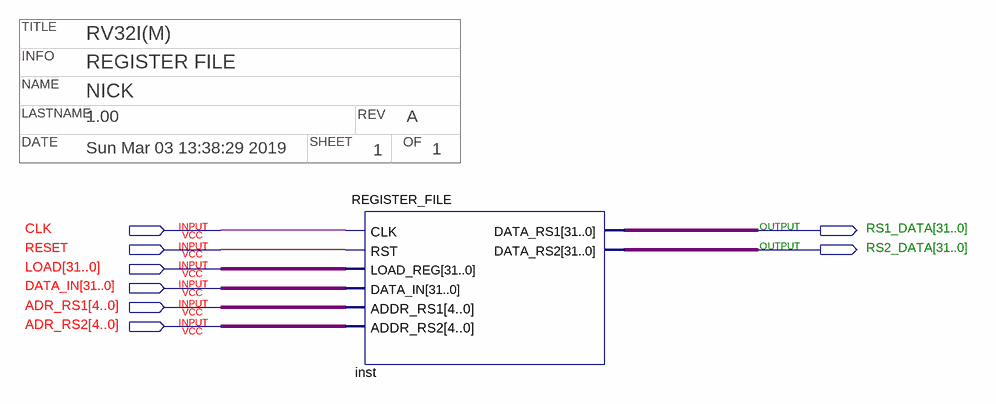
[diagram p0: schematic sheet]
// Quartus schematic REGISTER_FILETEST.bdf as structural Verilog: 1 symbols, 8 pins
// Title block: TITLE: RV32I(M); INFO: REGISTER FILE; NAME: NICK; LASTNAME: 1.00; REV: A; DATE: Sun Mar 03 13:38:29 2019; SHEET: 1; OF: 1
module REGISTER_FILETEST (
  input  CLK,
  input  RESET,
  input  [31:0] LOAD,
  input  [31:0] DATA_IN,
  input  [4:0] ADR_RS1,
  input  [4:0] ADR_RS2,
  output [31:0] RS1_DATA,
  output [31:0] RS2_DATA
);

  REGISTER_FILE inst (
    .CLK(CLK), .RST(RESET), .LOAD_REG(LOAD), .DATA_IN(DATA_IN), .ADDR_RS1(ADR_RS1), .ADDR_RS2(ADR_RS2),
    .DATA_RS1(RS1_DATA), .DATA_RS2(RS2_DATA));
endmodule
